# EAGLE design guhPLC_SmartMeterInterface (EAGLE 6.1)
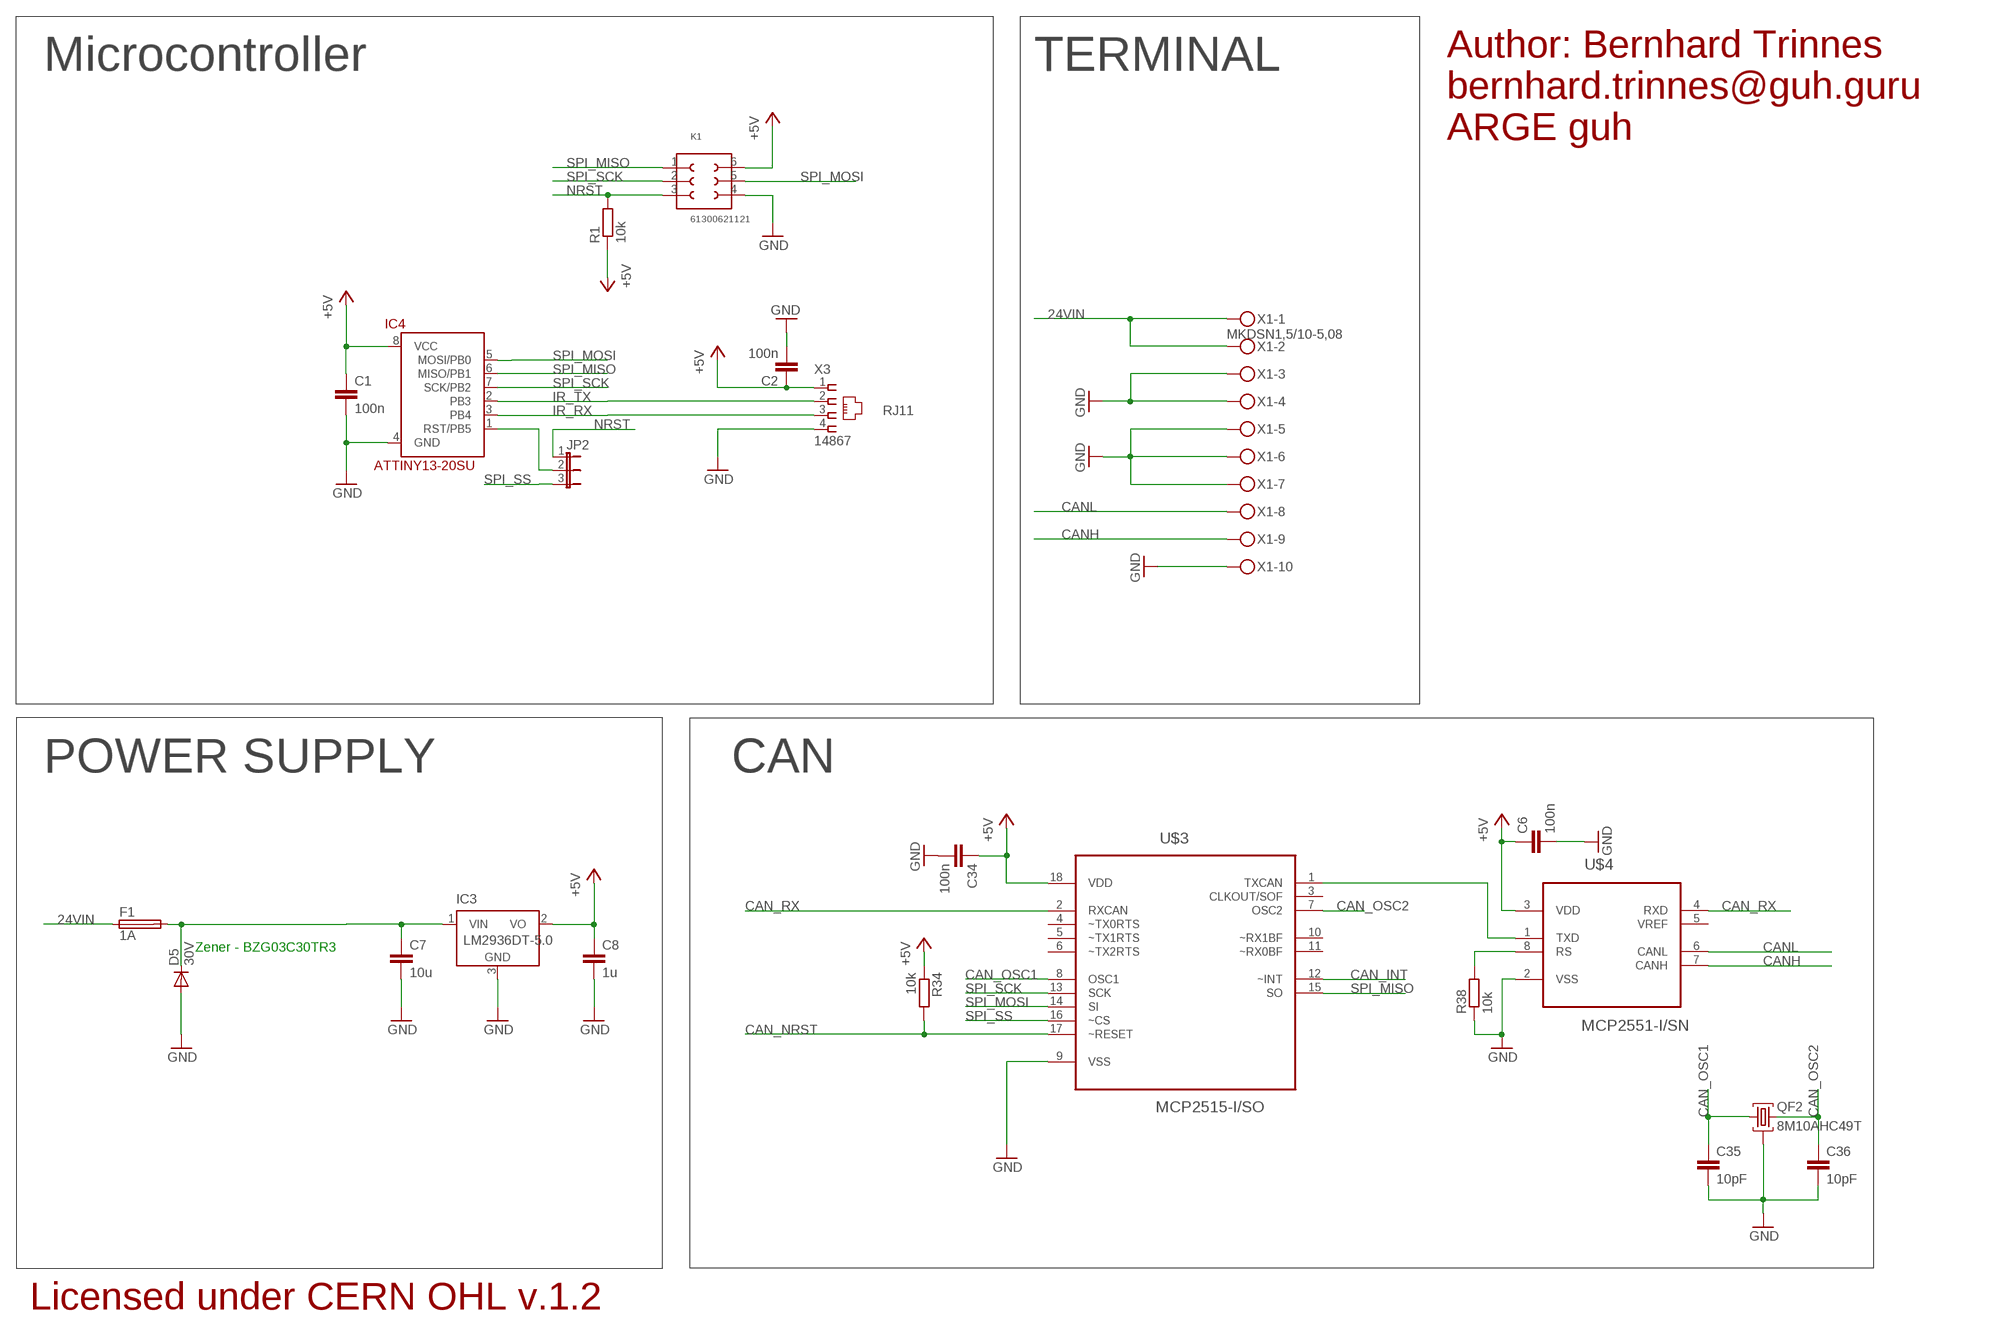
[diagram p0: schematic, sheet 1]

## Parts
C1  100n  C-EUC0603  [C0603]
C2  100n  C-EUC0603  [C0603]
C6  100n  C-EUC0603  [C0603]
C7  10u  C-EUC1206  [C1206]
C8  1u  C-EUC0603  [C0603]
C34  100n  C-EUC0603  [C0603]
C35  10pF  C-EUC0603  [C0603]
C36  10pF  C-EUC0603  [C0603]
D5  30V  DIODE-DO214AC  [DO214AC]
F1  1A  LITTLEFUSE  [LITTLEFUSE]
IC3  LM2936DT-5.0  [TO252]
IC4  ATTINY13-20SU  [SOIC8]
JP2  JP2E  [JP2]
K1  61300621121  [61300621121]
QF2  8M10AHC49T  [HC49U]
R1  10k  R-EU_R0603  [R0603]
R34  10k  R-EU_R0603  [R0603]
R38  10k  R-EU_R0603  [R0603]
U$3  MCP2515-I/SO  [SOIC127P1034X264-18N]
U$4  MCP2551-I/SN  [SOIC127P600X175-8N]
X1  MKDSN1,5/10-5,08  [MKDSN1,5/10-5,08]
X3  14867  [14867]

## Nets
24VIN: F1.1 X1.1 X1.2
+5V: C1.1 C2.1 C6.1 C8.1 C34.1 IC3.2(VO) IC4.8(VCC) K1.6 R1.1 R34.1 U$3.18(VDD) U$4.3(VDD) X3.1
CAN_INT: U$3.12(~INT)
CAN_NRST: R34.2 U$3.17(~RESET)
CAN_OSC1: C35.1 QF2.1 U$3.8(OSC1)
CAN_OSC2: C36.1 QF2.3 U$3.7(OSC2)
CAN_RX: U$3.2(RXCAN) U$4.4(RXD)
CANH: U$4.7(CANH) X1.9
CANL: U$4.6(CANL) X1.8
GND [gnd]: C1.2 C2.2 C6.2 C7.2 C8.2 C34.2 C35.2 C36.2 D5.A IC3.3(GND) IC4.4(GND) K1.4 QF2.2 R38.1 U$3.9(VSS) U$4.2(VSS) X1.3 X1.4 X1.5 X1.6 X1.7 X1.10 X3.4
IR_RX: IC4.3(PB4) X3.3
IR_TX: IC4.2(PB3) X3.2
N$2: IC4.1(RST/PB5) JP2.2
N$20: U$3.1(TXCAN) U$4.1(TXD)
N$24: R38.2 U$4.8(RS)
NRST: JP2.1 K1.3 R1.2
SPI_MISO: IC4.6(MISO/PB1) K1.1 U$3.15(SO)
SPI_MOSI: IC4.5(MOSI/PB0) K1.5 U$3.14(SI)
SPI_SCK: IC4.7(SCK/PB2) K1.2 U$3.13(SCK)
SPI_SS: JP2.3 U$3.16(~CS)
VCC [power]: C7.1 D5.C F1.2 IC3.1(VIN)
Unconnected: U$3.3(CLKOUT/SOF) U$3.4(~TX0RTS) U$3.5(~TX1RTS) U$3.6(~TX2RTS) U$3.10(~RX1BF) U$3.11(~RX0BF) U$4.5(VREF)

## Notes on the sheet
- Author: Bernhard Trinnes
- Microcontroller | TERMINAL
- bernhard.trinnes@guh.guru
- ARGE guh
- RJ11
- POWER SUPPLY | CAN
- Zener - BZG03C30TR3
- Licensed under CERN OHL v.1.2

## Library data of the parts
C1 C2 C6-C8 C34-C36 = resistor:C-EU: CAPACITOR, European symbol
D5 = diode:DIODE-: DIODE
F1 = fuse:LITTLEFUSE: LITTLEFUSE Picofuse/slow Littlefuse; OC_FARNELL: unknown; OC_NEWARK: unknown
IC3 = national-semiconductor:LM2936?*: Ultra-Low Quiescent Current LDO Voltage Regulator Source: Data sheet <http://www.national.com/ds/LM/LM2936.pdf>; MF: NATIONAL SEMICONDUCTOR; MPN: LM2936DT-5.0/NOPB; OC_FARNELL: 1286864; OC_NEWARK: 41K4501
IC4 = attiny13:ATTINY13-20*
JP2 = jumper:JP2E: JUMPER
K1 = EagleLibrary_Wuerth_Elektronik_eiCan_Board_to_Board_Connectors_v6_20150113:61300621121: WR-PHD 2.54mm Dual Pin Header, 6 Pins =>Code : Con_BTB_PHD_2.54_2_61300621121 <http://katalog.we-online.de/media/images/eican/Con_BTB_PHD_2.54_2_6130xx21121_pf2.jpg> Details see: http://katalog.we-online.de/en/em/613_0xx_211_21 Created 2014-05-29, Karrer Zheng 2014 (C) Würth Elektronik
QF2 = crystal:8M10AHC49T: Monolithic Crystal Filters Source: www.vanlong.com; OC_FARNELL: unknown; OC_NEWARK: unknown
R1 R34 R38 = resistor:R-EU_: RESISTOR, European symbol
U$3 = guh:MCP2515-I/SO: CAN Controller; MPN: MCP2515-I/SO; OC_FARNELL: 1292239; OC_NEWARK: 29H7136; PACKAGE: SOIC-18; SUPPLIER: Microchip
U$4 = guh:MCP2551-I/SN: High-Speed CAN Transceiver; MPN: MCP2551-I/SN; OC_FARNELL: 9758569; OC_NEWARK: 69K7604; PACKAGE: SOIC-8; SUPPLIER: Microchip
X1 = con-phoenix-508:MKDSN1,5/10-5,08: MKDSN 1,5/10-5,08 Printklemme Nennstrom: 13,5 A Nennspannung: 250 V Rastermaß: 5,08 mm Polzahl: 10 Anschlussart: Schraubanschluss Montage: Löten Anschlussrichtung Leiter/Platine: 0 ° Artikelnummer: 1729209 Source: http://eshop.phoenixcontact.com .. 1729209.pdf; MPN: SMKDSN1,5/10-5,08; OC_FARNELL: 1792913; OC_NEWARK: 70R0297
X3 = con-4ucon:14867: RJ11 Connector Source: 4UCON TECHNOLOGY INC. 14867.pdf; OC_FARNELL: unknown; OC_NEWARK: unknown

## Net classes
0 default: width 0.254 mm, clearance 0.254 mm
1 power: width 0.61 mm, drill 0.61 mm, clearance 0.254 mm
2 gnd: width 0.305 mm, drill 0.559 mm, clearance 0.254 mm

## Board
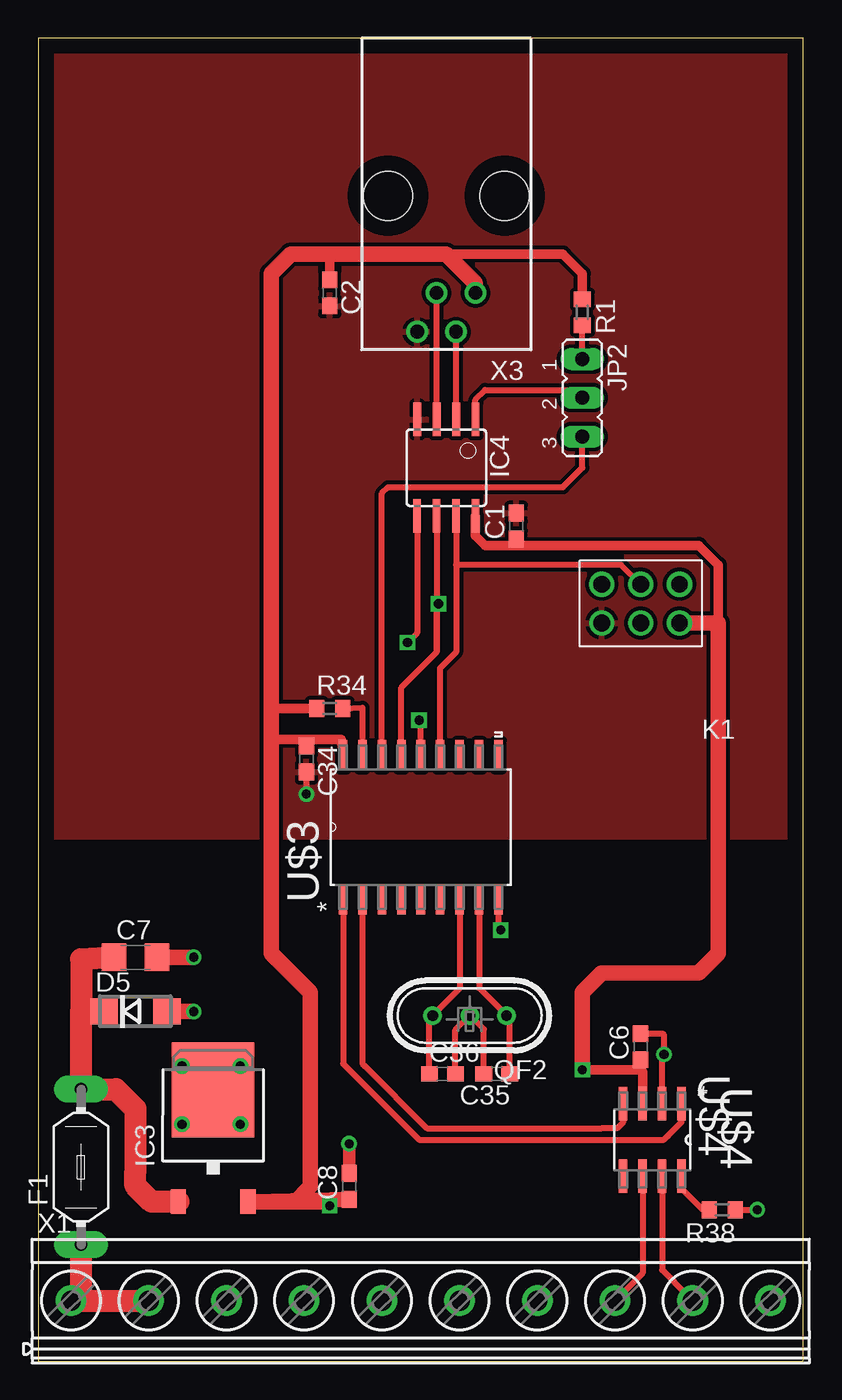
[diagram p1: board, top side]
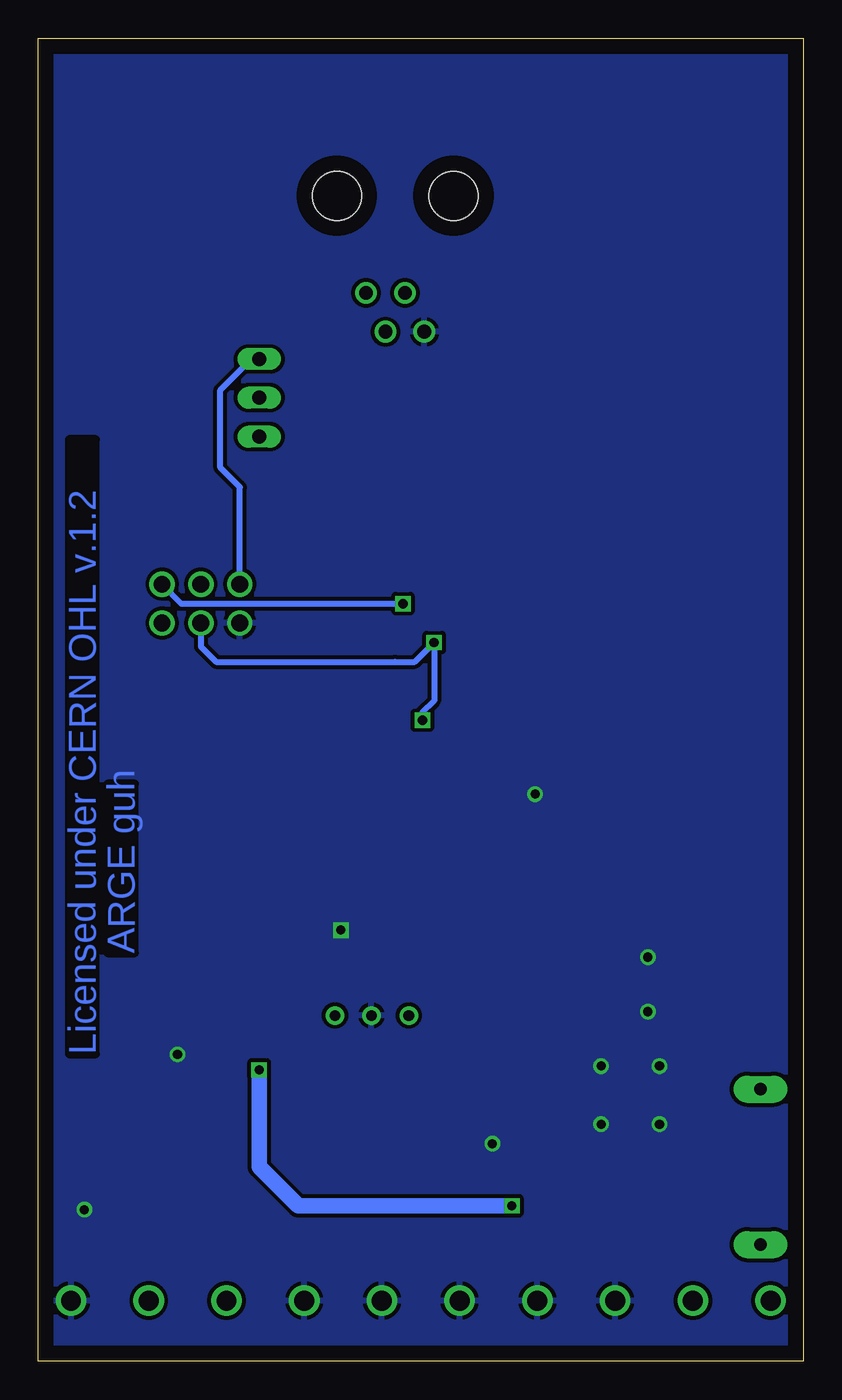
[diagram p2: board, bottom side, seen from below]

Size 50 x 86.5 mm. Coordinates in mm from the lower left corner, seen from the top.
Outline: 0,0 50,0 50,86.5 0,86.5 0,0
Copper layers (1*16): Top 0.035mm / dielectric 1.5mm / Bottom 0.035mm
Design rules: minimum track width 10mil, minimum drill 24mil, track to track 8mil, track to pad 8mil, pad to pad 8mil, via to via 8mil, smd to smd 8mil, copper to edge 40mil, drill to drill 8mil, minimum pad ring 10mil, minimum via ring 8mil, stop-mask expansion 4mil, vias tented up to drill 0mil, thermal gap 10mil

### Footprints (pad centres in the part's own frame; a part is rotated, then mirrored left to right if it is on the bottom)
C0603 = smd 1.1 x 1: 1 -0.85,0; 2 0.85,0
C1206 = smd 1.6 x 1.8: 1 -1.4,0; 2 1.4,0
DO214AC = smd 1.8 x 1.7: A 2.05,0; C -2.05,0
LITTLEFUSE = drill 0.813 pad 1.778 long: 1 -5.08,0; 2 5.08,0
TO252 = smd 1 x 1.6: 1 -2.28,-4.8; 2 2.28,-4.8 | smd 5.4 x 6.2: 3 0,2.5
SOIC8 = smd 0.5 x 2.2: 1 -1.905,-3.154; 2 -0.645,-3.154; 3 0.625,-3.154; 4 1.895,-3.154; 5 1.905,3.154; 6 0.635,3.154; 7 -0.635,3.154; 8 -1.905,3.154
JP2 = drill 0.914 long: 1 -2.54,0; 2 0,0; 3 2.54,0
61300621121 = drill 1.1: 1 -2.54,0; 2 0,0; 3 2.54,0; 4 2.54,2.54; 5 0,2.54; 6 -2.54,2.54
HC49U = drill 0.7 pad 1.2: 1 -2.413,0; 2 -0.027,0; 3 2.413,0
R0603 = smd 1 x 1.1: 1 -0.85,0; 2 0.85,0
SOIC127P1034X264-18N = smd 1.981 x 0.559: 1 -4.699,5.08; 2 -4.699,3.81; 3 -4.699,2.54; 4 -4.699,1.27; 5 -4.699,0; 6 -4.699,-1.27; 7 -4.699,-2.54; 8 -4.699,-3.81; 9 -4.699,-5.08; 10 4.699,-5.08; 11 4.699,-3.81; 12 4.699,-2.54; 13 4.699,-1.27; 14 4.699,0; 15 4.699,1.27; 16 4.699,2.54; 17 4.699,3.81; 18 4.699,5.08
SOIC127P600X175-8N = smd 2.184 x 0.559: 1 -2.362,1.905; 2 -2.362,0.635; 3 -2.362,-0.635; 4 -2.362,-1.905; 5 2.362,-1.905; 6 2.362,-0.635; 7 2.362,0.635; 8 2.362,1.905
MKDSN1,5/10-5,08 = drill 1.3 pad 2: 1 -22.881,0.025; 2 -17.801,0.025; 3 -12.721,0.025; 4 -7.641,0.025; 5 -2.561,0.025; 6 2.519,0.025; 7 7.599,0.025; 8 12.679,0.025; 9 17.759,0.025; 10 22.839,0.025
14867 = drill 0.9 pad 1.422: 1 -1.905,6.35; 2 -0.635,8.89; 3 0.635,6.35; 4 1.905,8.89 | hole 3.2: -3.81,0; 3.81,0

### Placement (x,y rotation side)
C1  31.24,54.61 90 top
C2  19.05,69.85 270 top
C6  39.37,20.57 90 top
C7  6.35,26.42 0 top
C8  20.32,11.43 90 top
C34  17.53,39.37 270 top
C35  29.97,18.8 180 top
C36  26.42,18.8 0 top
D5  6.35,22.86 0 top
F1  2.79,12.7 90 top
IC3  11.43,15.24 0 top
IC4  26.67,58.42 180 top
JP2  35.56,62.99 270 top
K1  39.37,50.8 180 top
QF2  28.19,22.61 180 top
R1  35.56,68.58 270 top
R34  19.05,42.67 0 top
R38  44.7,9.91 180 top
U$3  25,34.92 90 top
U$4  40.13,14.48 270 top
X1  25.02,3.94 0 top
X3  26.67,76.2 180 top

### Tracks (layer width: path | path; a pad name or v marks a point on that pad's centre or on a via)
24VIN
  Top 1.422: X1.2 X1.1 2.79,4.36 F1.1
+5V  (via drill 0.6)
  Top 0.406: C6.1 arc-90 39.5,19.6 39.5,18.92 U$4.3 | U$3.18 19.92,39.77 | C34.1 17.53,40.39 17.78,40.64 | 44.45,48.26 44.45,45.72
  Top 0.61: 39.5,18.92 U$4.3 | R1.1 35.56,71.12 34.29,72.39 26.67,72.39 | 19.92,39.77 19.81,40.64 17.78,40.64 15.24,40.64 | IC4.8 28.57,53.98 29.21,53.34 31.24,53.34 | 31.24,53.34 43.18,53.34 44.45,52.07 44.45,48.26 | R34.1 15.24,42.67 | v35.56,19.05 39.37,19.05 C6.1 | C2.1 19.05,72.39 | C1.1 31.24,53.34
  Top 1.016: X3.1 28.57,70.48 26.67,72.39 19.05,72.39 16.51,72.39 15.24,71.12 15.24,42.67 15.24,40.64 15.24,33.02 15.24,26.67 17.78,24.13 17.78,17.78 17.78,15.24 17.78,11.43 16.79,10.44 | IC3.2 13.97,10.44 | 13.97,10.44 16.79,10.44 | C8.1 13.97,10.44 | 16.79,10.44 18.77,10.44 v19.05,10.16 | v35.56,19.05 35.56,24.13 36.83,25.4 43.18,25.4 44.45,26.67 44.45,45.72 44.45,48.26 K1.6
  Bottom 1.016: v35.56,19.05 35.56,12.7 33.02,10.16 v19.05,10.16
CAN_NRST
  Top 0.406: R34.2 21.19,42.73 U$3.17
CAN_OSC1
  Top 0.406: C35.1 30.82,22.39 QF2.1 28.81,24.4 U$3.8
CAN_OSC2
  Top 0.406: C36.1 25.57,22.39 QF2.3 27.54,24.36 U$3.7
CAN_RX
  Top 0.406: U$4.4 38.23,15.62 37.85,15.24 36.83,15.24 25.4,15.24 21.34,19.3 21.19,19.45 21.19,27.43 U$3.2
CANH
  Top 0.406: U$4.7 40.77,5.97 42.42,4.32 | 42.42,4.32 42.67,4.06 | X1.9 42.42,4.32
CANL
  Top 0.406: U$4.6 39.5,5.76 X1.8
GND  (via drill 0.6)
  Top 0.406: U$3.9 30.08,28.34 | 30.08,28.34 v30.23,28.19 30.08,28.34 | U$4.2 40.77,19.94 v40.89,20.07 40.89,21.34 40.81,21.42 C6.2 | R38.1 v46.99,9.91 | C34.2 v17.53,37.08 | C35.2 29.12,21.7 QF2.2 27.27,21.65 C36.2
  Top 0.813: C8.2 v20.32,14.22 | v13.21,19.3 12.7,19.3 IC3.3
  Top 1.016: C7.2 v10.16,26.42 | v10.16,22.86 D5.A
  other vias: 13.21,15.49 9.4,19.3 9.4,15.49
  pour Bottom (rank 6): -3.81,90.17 54.61,90.17 54.61,-7.62 -3.81,-7.62
  pour Top (isolate 0.2): 0,87.63 50.8,87.63 50.8,34.29 0,34.29
IR_RX
  Top 0.406: IC4.3 X3.3
IR_TX
  Top 0.406: IC4.2 X3.2
N$2
  Top 0.406: IC4.1 28.57,62.87 29.21,63.5 35.05,63.5 JP2.2
N$20
  Top 0.406: U$3.1 19.92,19.45 24.89,14.48 37.59,14.48 40.89,14.48 41.15,14.73 42.04,15.62 U$4.1
N$24
  Top 0.406: R38.2 43.43,9.91 42.16,11.18 42.04,11.3 U$4.8
NRST
  Top 0.406: JP2.1 R1.2
  Bottom 0.406: K1.3 36.83,57.15 38.1,58.42 38.1,63.5 36.83,64.77 36.07,65.53 JP2.1
SPI_MISO  (via drill 0.6)
  Top 0.406: IC4.6 26.04,49.53 | 26.04,49.53 26.04,46.35 | 26.04,46.35 24.13,44.45 23.73,44.05 U$3.15 | 26.04,46.35 26.04,49.53 | 26.04,49.53 v26.16,49.53
  Bottom 0.406: K1.1 40.64,49.53 v26.16,49.53
SPI_MOSI  (via drill 0.6)
  Top 0.406: IC4.5 24.77,47.62 v24.13,46.99 | U$3.14 25,41.8 v24.89,41.91
  Bottom 0.406: K1.5 39.37,46.72 38.37,45.72 26.67,45.72 25.4,45.72 v24.13,46.99 24.13,43.18 24.89,42.42 v24.89,41.91
SPI_SCK
  Top 0.406: IC4.7 27.3,52.07 | 27.3,52.07 27.3,46.35 26.67,45.72 26.27,45.32 U$3.13 | K1.2 38.1,52.07 27.3,52.07
SPI_SS
  Top 0.406: U$3.16 22.46,56.75 22.86,57.15 34.29,57.15 35.56,58.42 JP2.3
VCC
  Top 1.422: 2.79,22.86 F1.2 5.08,17.78 6.35,16.51 6.35,12.45 6.35,11.48 7.39,10.44 8.89,10.44 IC3.1 | D5.C 2.79,22.86 | C7.1 2.79,26.29 2.79,22.86

### Text on the board
Bottom: ARGE guh | Licensed under CERN OHL v.1.2
tDocu: Author: Bernhard Trinnes | bernhard.trinnes@guh.guru